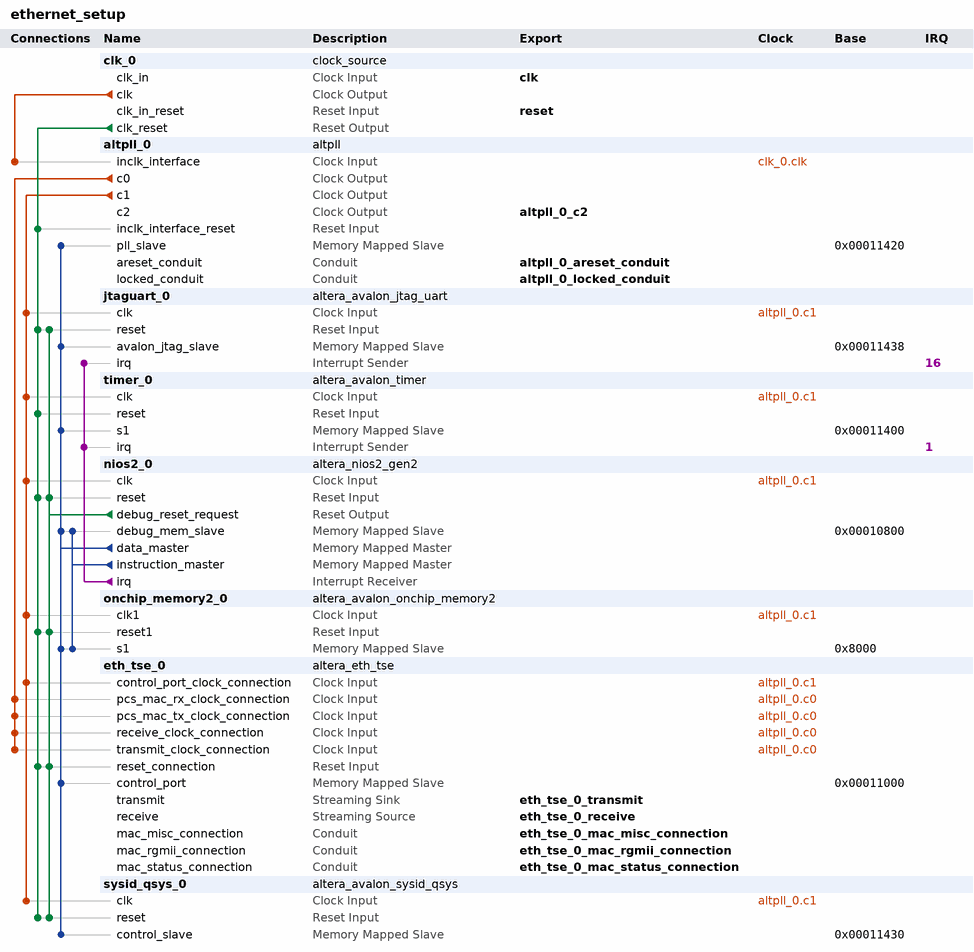
[diagram p0: system contents]
# Platform Designer (Qsys) system ethernet_setup, MAX 10 10M50DAF484C6GES
# Parameters at their usual value, and those the tool derives, are not listed.
package require -exact qsys 23.1
create_system ethernet_setup
set_project_property DEVICE_FAMILY {MAX 10}
set_project_property DEVICE 10M50DAF484C6GES

add_instance clk_0 clock_source 23.1
set_instance_parameter_value clk_0 clockFrequency 25000000

add_instance altpll_0 altpll 23.1
set_instance_parameter_value altpll_0 CLK0_DIVIDE_BY 1
set_instance_parameter_value altpll_0 CLK0_MULTIPLY_BY 5
set_instance_parameter_value altpll_0 CLK1_DIVIDE_BY 1
set_instance_parameter_value altpll_0 CLK1_DUTY_CYCLE 50
set_instance_parameter_value altpll_0 CLK1_MULTIPLY_BY 2
set_instance_parameter_value altpll_0 CLK1_PHASE_SHIFT 0
set_instance_parameter_value altpll_0 CLK2_DIVIDE_BY 1
set_instance_parameter_value altpll_0 CLK2_DUTY_CYCLE 50
set_instance_parameter_value altpll_0 CLK2_MULTIPLY_BY 5
set_instance_parameter_value altpll_0 CLK2_PHASE_SHIFT 0
set_instance_parameter_value altpll_0 INCLK0_INPUT_FREQUENCY 40000
set_instance_parameter_value altpll_0 PORT_ARESET PORT_USED
set_instance_parameter_value altpll_0 PORT_LOCKED PORT_USED
set_instance_parameter_value altpll_0 PORT_clk1 PORT_USED
set_instance_parameter_value altpll_0 PORT_clk2 PORT_USED
set_instance_parameter_value altpll_0 PORT_clk3 PORT_UNUSED

add_instance jtaguart_0 altera_avalon_jtag_uart 23.1
set_instance_parameter_value jtaguart_0 simInteractiveOptions NO_INTERACTIVE_WINDOWS

add_instance timer_0 altera_avalon_timer 23.1
set_instance_parameter_value timer_0 period 1
set_instance_parameter_value timer_0 periodUnits MSEC

add_instance nios2_0 altera_nios2_gen2 23.1
set_instance_parameter_value nios2_0 dcache_size 2048
set_instance_parameter_value nios2_0 exceptionSlave onchip_memory2_0.s1
set_instance_parameter_value nios2_0 icache_size 4096
set_instance_parameter_value nios2_0 impl Fast
set_instance_parameter_value nios2_0 resetSlave onchip_memory2_0.s1

add_instance onchip_memory2_0 altera_avalon_onchip_memory2 23.1
set_instance_parameter_value onchip_memory2_0 dataWidth 32
set_instance_parameter_value onchip_memory2_0 dualPort false
set_instance_parameter_value onchip_memory2_0 initMemContent false
set_instance_parameter_value onchip_memory2_0 initializationFileName onchip_mem.hex
set_instance_parameter_value onchip_memory2_0 memorySize 20000

add_instance eth_tse_0 altera_eth_tse 23.1
set_instance_parameter_value eth_tse_0 XCVR_RCFG_JTAG_ENABLE 0
set_instance_parameter_value eth_tse_0 XCVR_SET_CAPABILITY_REG_ENABLE 0
set_instance_parameter_value eth_tse_0 XCVR_SET_CSR_SOFT_LOGIC_ENABLE 0
set_instance_parameter_value eth_tse_0 XCVR_SET_PRBS_SOFT_LOGIC_ENABLE 0
set_instance_parameter_value eth_tse_0 XCVR_SET_USER_IDENTIFIER 0
set_instance_parameter_value eth_tse_0 core_variation MAC_ONLY
set_instance_parameter_value eth_tse_0 enable_hd_logic false
set_instance_parameter_value eth_tse_0 enable_mac_flow_ctrl false
set_instance_parameter_value eth_tse_0 enable_magic_detect false
set_instance_parameter_value eth_tse_0 enable_shift16 true
set_instance_parameter_value eth_tse_0 ifGMII RGMII
set_instance_parameter_value eth_tse_0 ing_addr 11
set_instance_parameter_value eth_tse_0 mdio_clk_div 40
set_instance_parameter_value eth_tse_0 stat_cnt_ena false
set_instance_parameter_value eth_tse_0 transceiver_type NONE
set_instance_parameter_value eth_tse_0 useMDIO false

add_instance sysid_qsys_0 altera_avalon_sysid_qsys 23.1
set_instance_parameter_value sysid_qsys_0 id 0

# connections
add_connection altpll_0.c0 eth_tse_0.pcs_mac_rx_clock_connection clock
add_connection altpll_0.c0 eth_tse_0.pcs_mac_tx_clock_connection clock
add_connection altpll_0.c0 eth_tse_0.receive_clock_connection clock
add_connection altpll_0.c0 eth_tse_0.transmit_clock_connection clock
add_connection altpll_0.c1 eth_tse_0.control_port_clock_connection clock
add_connection altpll_0.c1 jtaguart_0.clk clock
add_connection altpll_0.c1 nios2_0.clk clock
add_connection altpll_0.c1 onchip_memory2_0.clk1 clock
add_connection altpll_0.c1 sysid_qsys_0.clk clock
add_connection altpll_0.c1 timer_0.clk clock
add_connection clk_0.clk altpll_0.inclk_interface clock
add_connection clk_0.clk_reset altpll_0.inclk_interface_reset reset
add_connection clk_0.clk_reset eth_tse_0.reset_connection reset
add_connection clk_0.clk_reset jtaguart_0.reset reset
add_connection clk_0.clk_reset nios2_0.reset reset
add_connection clk_0.clk_reset onchip_memory2_0.reset1 reset
add_connection clk_0.clk_reset sysid_qsys_0.reset reset
add_connection clk_0.clk_reset timer_0.reset reset
add_connection nios2_0.debug_reset_request eth_tse_0.reset_connection reset
add_connection nios2_0.debug_reset_request jtaguart_0.reset reset
add_connection nios2_0.debug_reset_request nios2_0.reset reset
add_connection nios2_0.debug_reset_request onchip_memory2_0.reset1 reset
add_connection nios2_0.debug_reset_request sysid_qsys_0.reset reset
add_connection nios2_0.data_master altpll_0.pll_slave avalon
set_connection_parameter_value nios2_0.data_master/altpll_0.pll_slave baseAddress 0x00011420
add_connection nios2_0.data_master eth_tse_0.control_port avalon
set_connection_parameter_value nios2_0.data_master/eth_tse_0.control_port baseAddress 0x00011000
add_connection nios2_0.data_master jtaguart_0.avalon_jtag_slave avalon
set_connection_parameter_value nios2_0.data_master/jtaguart_0.avalon_jtag_slave baseAddress 0x00011438
add_connection nios2_0.data_master nios2_0.debug_mem_slave avalon
set_connection_parameter_value nios2_0.data_master/nios2_0.debug_mem_slave baseAddress 0x00010800
add_connection nios2_0.data_master onchip_memory2_0.s1 avalon
set_connection_parameter_value nios2_0.data_master/onchip_memory2_0.s1 baseAddress 0x8000
add_connection nios2_0.data_master sysid_qsys_0.control_slave avalon
set_connection_parameter_value nios2_0.data_master/sysid_qsys_0.control_slave baseAddress 0x00011430
add_connection nios2_0.data_master timer_0.s1 avalon
set_connection_parameter_value nios2_0.data_master/timer_0.s1 baseAddress 0x00011400
add_connection nios2_0.instruction_master nios2_0.debug_mem_slave avalon
set_connection_parameter_value nios2_0.instruction_master/nios2_0.debug_mem_slave baseAddress 0x00010800
add_connection nios2_0.instruction_master onchip_memory2_0.s1 avalon
set_connection_parameter_value nios2_0.instruction_master/onchip_memory2_0.s1 baseAddress 0x8000
add_connection nios2_0.irq jtaguart_0.irq interrupt
set_connection_parameter_value nios2_0.irq/jtaguart_0.irq irqNumber 16
add_connection nios2_0.irq timer_0.irq interrupt
set_connection_parameter_value nios2_0.irq/timer_0.irq irqNumber 1

# exported interfaces
add_interface altpll_0_areset_conduit conduit end
set_interface_property altpll_0_areset_conduit EXPORT_OF altpll_0.areset_conduit
add_interface altpll_0_c2 clock source
set_interface_property altpll_0_c2 EXPORT_OF altpll_0.c2
add_interface altpll_0_locked_conduit conduit end
set_interface_property altpll_0_locked_conduit EXPORT_OF altpll_0.locked_conduit
add_interface clk clock sink
set_interface_property clk EXPORT_OF clk_0.clk_in
add_interface eth_tse_0_mac_misc_connection conduit end
set_interface_property eth_tse_0_mac_misc_connection EXPORT_OF eth_tse_0.mac_misc_connection
add_interface eth_tse_0_mac_rgmii_connection conduit end
set_interface_property eth_tse_0_mac_rgmii_connection EXPORT_OF eth_tse_0.mac_rgmii_connection
add_interface eth_tse_0_mac_status_connection conduit end
set_interface_property eth_tse_0_mac_status_connection EXPORT_OF eth_tse_0.mac_status_connection
add_interface eth_tse_0_receive avalon_streaming source
set_interface_property eth_tse_0_receive EXPORT_OF eth_tse_0.receive
add_interface eth_tse_0_transmit avalon_streaming sink
set_interface_property eth_tse_0_transmit EXPORT_OF eth_tse_0.transmit
add_interface reset reset sink
set_interface_property reset EXPORT_OF clk_0.clk_in_reset

set_interconnect_requirement {$system} qsys_mm.clockCrossingAdapter HANDSHAKE
set_interconnect_requirement {$system} qsys_mm.enableEccProtection FALSE
set_interconnect_requirement {$system} qsys_mm.insertDefaultSlave FALSE
set_interconnect_requirement {$system} qsys_mm.maxAdditionalLatency 1

save_system ethernet_setup.qsys
